# EAGLE schematic RFID_1 (EAGLE 6.2)
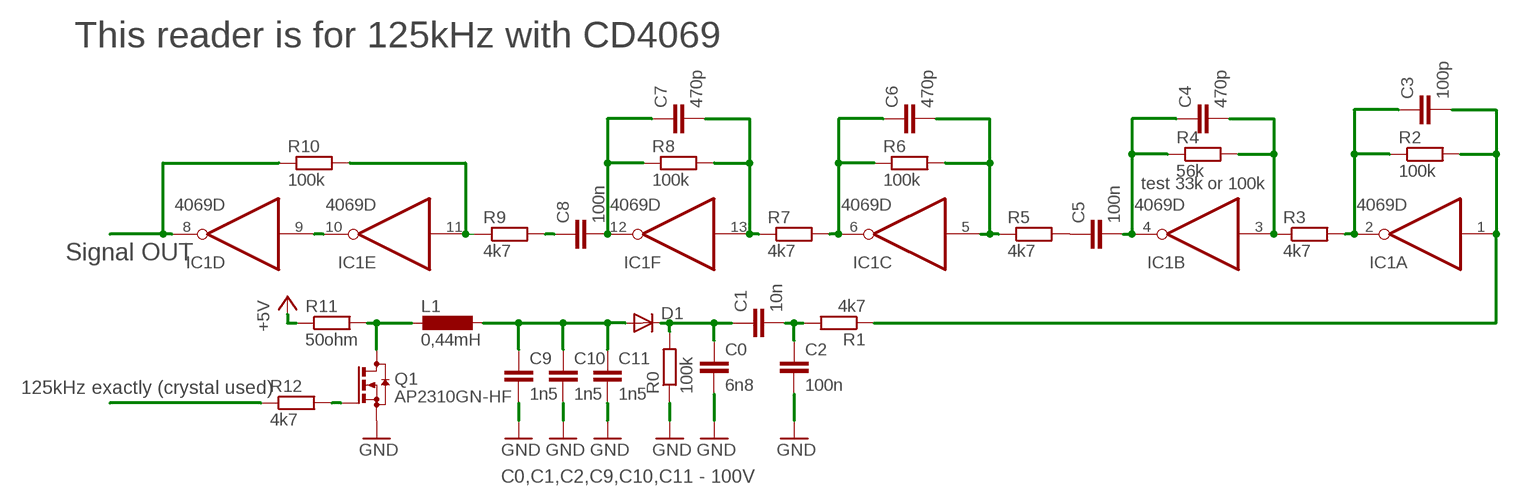
[diagram p0: schematic, sheet 1]

## Parts
C0  6n8  C-EUC0402  [C0402]
C1  10n  C-EUC0402  [C0402]
C2  100n  C-EUC0402  [C0402]
C3  100p  C-EUC0402  [C0402]
C4  470p  C-EUC0402  [C0402]
C5  100n  C-EUC0402  [C0402]
C6  470p  C-EUC0402  [C0402]
C7  470p  C-EUC0402  [C0402]
C8  100n  C-EUC0402  [C0402]
C9  1n5  C-EUC0402  [C0402]
C10  1n5  C-EUC0402  [C0402]
C11  1n5  C-EUC0402  [C0402]
D1  DIODE-MINIMELF  [MINIMELF]
IC1  4069D  [SO14]
L1  0,44mH  L-EUL1812  [L1812]
Q1  AP2310GN-HF  BSS123  [SOT23]
R0  100k  R-EU_R0402  [R0402]
R1  4k7  R-EU_R0402  [R0402]
R2  100k  R-EU_R0402  [R0402]
R3  4k7  R-EU_R0402  [R0402]
R4  56k  R-EU_R0402  [R0402]
R5  4k7  R-EU_R0402  [R0402]
R6  100k  R-EU_R0402  [R0402]
R7  4k7  R-EU_R0402  [R0402]
R8  100k  R-EU_R0402  [R0402]
R9  4k7  R-EU_R0402  [R0402]
R10  100k  R-EU_R0402  [R0402]
R11  50ohm  R-EU_R1206  [R1206]
R12  4k7  R-EU_R0805  [R0805]

## Nets
+5V: R11.1
GND: C0.2 C2.2 C9.2 C10.2 C11.2 Q1.2(S) R0.1
N$1: C0.1 C1.1 D1.C R0.2
N$2: C3.1 IC1.2(A:O) R2.1 R3.2
N$3: C3.2 IC1.1(A:I) R1.1 R2.2
N$4: C1.2 C2.1 R1.2
N$5: C4.2 IC1.3(B:I) R3.1 R4.2
N$6: C4.1 C5.2 IC1.4(B:O) R4.1
N$7: C5.1 R5.2
N$8: C6.2 IC1.5(C:I) R5.1 R6.2
N$9: C6.1 IC1.6(C:O) R6.1 R7.2
N$10: C7.2 IC1.13(F:I) R7.1 R8.2
N$11: C7.1 C8.2 IC1.12(F:O) R8.1
N$12: IC1.9(D:I) IC1.10(E:O)
N$13: C8.1 R9.2
N$14: IC1.11(E:I) R9.1 R10.2
N$15: IC1.8(D:O) R10.1
N$16: L1.2 Q1.3(D) R11.2
N$17: Q1.1(G) R12.2
N$18: R12.1
N$19: C9.1 C10.1 C11.1 D1.A L1.1

## Notes on the sheet
- This reader is for 125kHz with CD4069
- test 33k or 100k
- Signal OUT
- 125kHz exactly (crystal used)
- C0,C1,C2,C9,C10,C11 - 100V

## Power pins joined to a net without a drawn wire
VDD: IC1.14(P:VDD)
VSS: IC1.7(P:VSS)

## Library data of the parts
C0 C1-C11 = rcl:C-EU: CAPACITOR, European symbol
D1 = diode:DIODE-: DIODE
IC1 = 40xx:4069: Hex INVERTER
L1 = rcl:L-EU: INDUCTOR, European symbol
Q1 = transistor-small-signal:BSS123: N-CHANNEL MOS FET
R0 R1-R12 = rcl:R-EU_: RESISTOR, European symbol